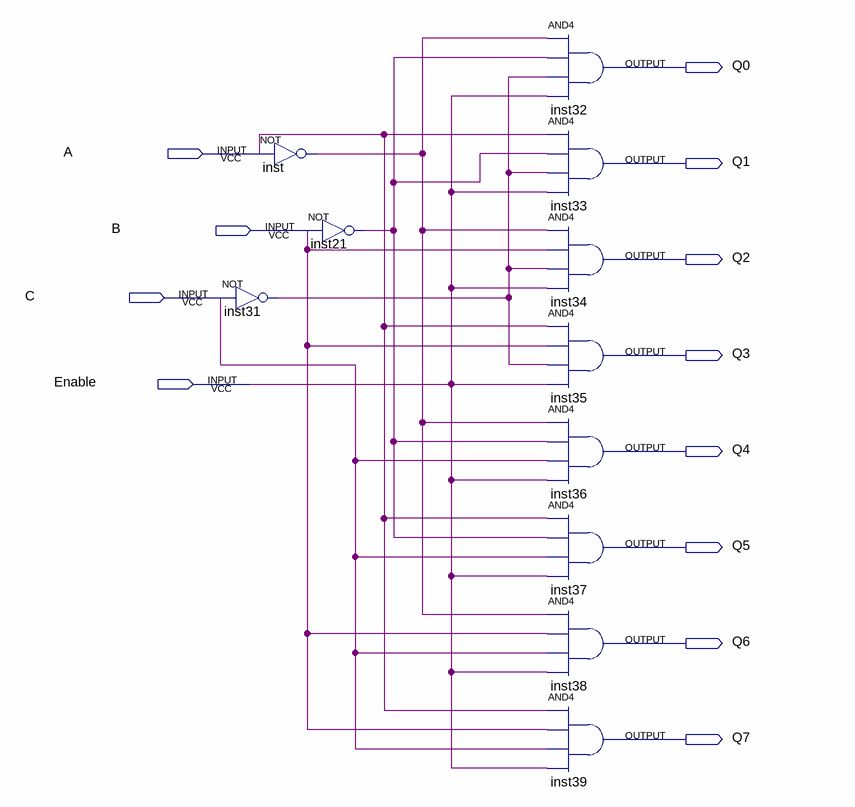
[diagram p0: schematic sheet]
// Quartus schematic lab02.bdf as structural Verilog: 11 symbols, 12 pins
module lab02 (
  input  A,
  input  B,
  input  C,
  input  Enable,
  output Q0,
  output Q1,
  output Q2,
  output Q3,
  output Q4,
  output Q5,
  output Q6,
  output Q7
);

  wire inst21_out, inst31_out, inst_out;

  not inst (inst_out, A);
  not inst31 (inst31_out, C);
  not inst21 (inst21_out, B);
  and inst32 (Q0, inst_out, inst21_out, inst31_out, Enable);
  and inst33 (Q1, A, inst21_out, inst31_out, Enable);
  and inst34 (Q2, inst_out, B, inst31_out, Enable);
  and inst35 (Q3, A, B, inst31_out, Enable);
  and inst36 (Q4, inst_out, inst21_out, C, Enable);
  and inst37 (Q5, A, inst21_out, C, Enable);
  and inst38 (Q6, inst_out, B, C, Enable);
  and inst39 (Q7, A, B, C, Enable);
endmodule
